# EAGLE design avr-node (EAGLE 7.2.0)
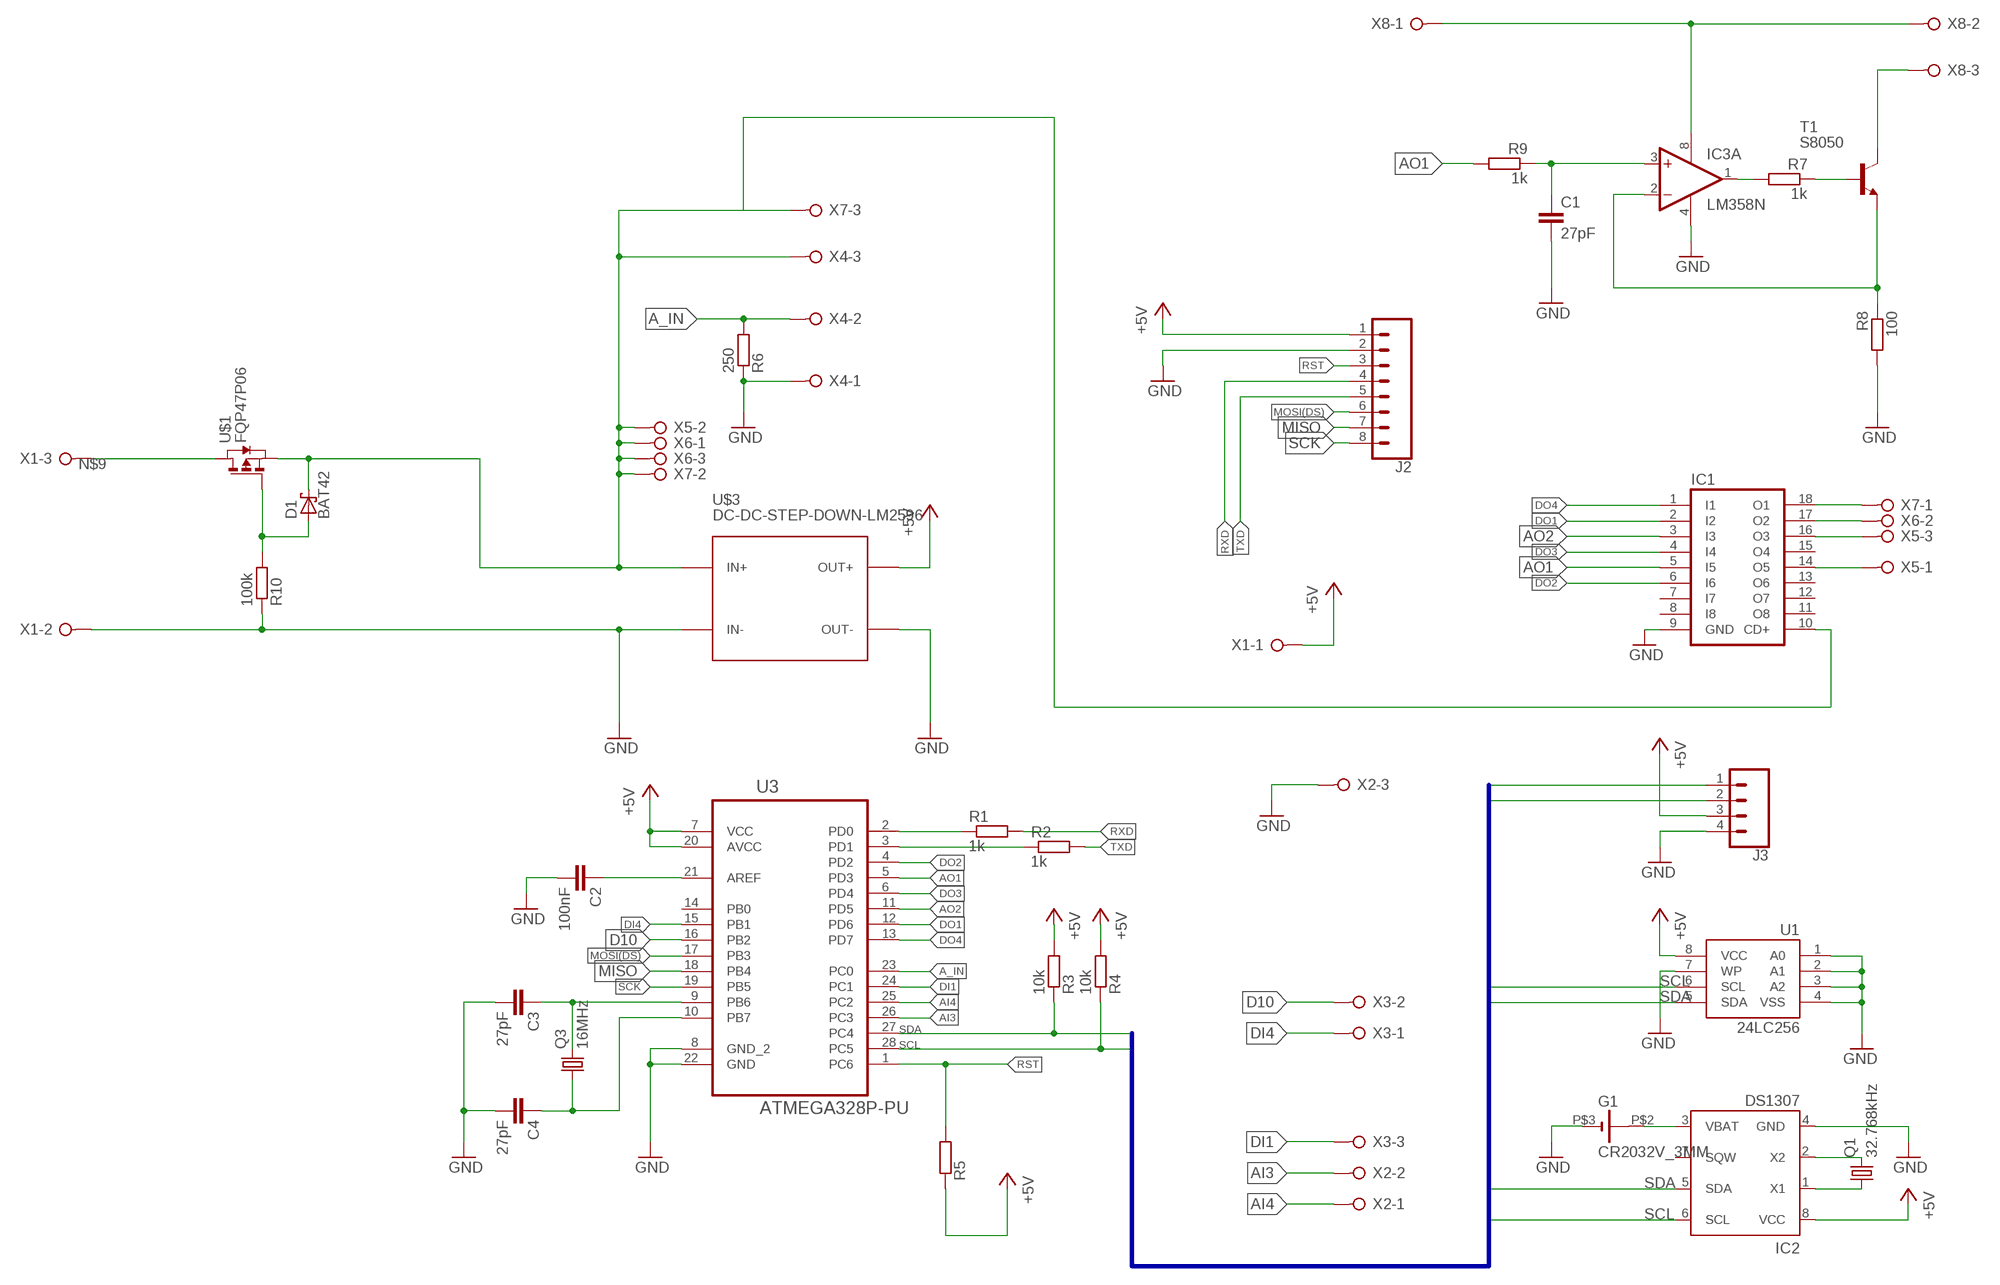
[diagram p0: schematic, sheet 1]

## Parts
C1  27pF  C-EU050-025X075  [C050-025X075]
C2  100nF  C-EU050-025X075  [C050-025X075]
C3  27pF  C-EU050-025X075  [C050-025X075]
C4  27pF  C-EU050-025X075  [C050-025X075]
D1  BAT42  [DO35-10]
G1  CR2032V_3MM  [CR2032V_3MM]
IC1  ULN2803A  [DIL18]
IC2  DS1307  [DIL08]
IC3  LM358N  [DIL08]
J2  CONN_08LONGPADS  [1X08_LONGPADS]
J3  CONN_04PTH  [1X04]
Q1  32.768kHz  CRYSTALTC26V  [TC26V]
Q3  16MHz  CRYSTALHC49U-V  [HC49U-V]
R1  1k  R-EU_0204/7  [0204/7]
R2  1k  R-EU_0204/7  [0204/7]
R3  10k  R-EU_0204/7  [0204/7]
R4  10k  R-EU_0204/7  [0204/7]
R5  R-EU_0204/7  [0204/7]
R6  250  R-EU_0204/7  [0204/7]
R7  1k  R-EU_0204/7  [0204/7]
R8  100  R-EU_0204/7  [0204/7]
R9  1k  R-EU_0204/7  [0204/7]
R10  100k  R-EU_0204/7  [0204/7]
T1  S8050  -NPN-TO92L  [TO92L]
U1  24LC256  EEPROM-I2CSMD  [SO08]
U3  ATMEGA328P-PU  [DIP254P762X457-28]
U$1  FQP47P06  [TO220]
U$3  DC-DC-STEP-DOWN-LM2596  [DC-DC-STEP-DOWN-LM2596]
X1  W237-3E  [W237-3E]
X2  W237-3E  [W237-3E]
X3  W237-3E  [W237-3E]
X4  W237-3E  [W237-3E]
X5  W237-3E  [W237-3E]
X6  W237-3E  [W237-3E]
X7  W237-3E  [W237-3E]
X8  W237-3E  [W237-3E]

## Nets
+5V: IC2.8(VCC) J2.1 J3.3 R3.2 R4.2 R5.1 U1.8(VCC) U3.7(VCC) U3.20(AVCC) U$3.OUT+ X1.1
A_IN: R6.2 U3.23(PC0) X4.2
AI3: U3.26(PC3) X2.2
AI4: U3.25(PC2) X2.1
AO1: IC1.5(I5) R9.2 U3.5(PD3)
AO2: IC1.3(I3) U3.11(PD5)
AO_SUP: IC3.8(P:V+) X8.1 X8.2
D10: U3.16(PB2) X3.2
DI1: U3.24(PC1) X3.3
DI4: U3.15(PB1) X3.1
DO1: IC1.2(I2) U3.12(PD6)
DO2: IC1.6(I6) U3.4(PD2)
DO3: IC1.4(I4) U3.6(PD4)
DO4: IC1.1(I1) U3.13(PD7)
GND: C1.2 C2.2 C3.2 C4.2 G1.P$3(-) IC1.9(GND) IC2.4(GND) IC3.4(P:V-) J2.2 J3.4 R6.1 R8.2 R10.1 U1.1(A0) U1.2(A1) U1.3(A2) U1.4(VSS) U1.7(WP) U3.8(GND_2) U3.22(GND) U$3.IN- U$3.OUT- X1.2 X2.3 X4.1
MISO: J2.7 U3.18(PB4)
MOSI(DS): J2.6 U3.17(PB3)
N$1: IC3.1(A:OUT) R7.2
N$2: R7.1 T1.2(B)
N$3: R1.1 U3.2(PD0)
N$4: R2.1 U3.3(PD1)
N$5: T1.3(C) X8.3
N$6: C2.1 U3.21(AREF)
N$7: C3.1 Q3.2 U3.9(PB6)
N$8: C4.1 Q3.1 U3.10(PB7)
N$9: U$1.2(D) X1.3
N$10: IC1.16(O3) X5.3
N$11: IC1.17(O2) X6.2
N$12: IC1.14(O5) X5.1
N$15: IC1.18(O1) X7.1
N$17: IC3.2(A:-IN) R8.1 T1.1(E)
N$18: D1.A R10.2 U$1.1(G)
N$20: C1.1 IC3.3(A:+IN) R9.1
N$22: IC2.2(X2) Q1.2
N$23: IC2.1(X1) Q1.1
N$28: G1.P$2(+) IC2.3(VBAT)
RST: J2.3 R5.2 U3.1(PC6)
RXD: J2.4 R1.2
SCK: J2.8 U3.19(PB5)
SCL: IC2.6(SCL) J3.1 R4.1 U1.6(SCL) U3.28(PC5)
SDA: IC2.5(SDA) J3.2 R3.1 U1.5(SDA) U3.27(PC4)
TXD: J2.5 R2.2
V_IN: D1.C IC1.10(CD+) U$1.3(S) U$3.IN+ X4.3 X5.2 X6.1 X6.3 X7.2 X7.3
Unconnected: G1.P$1(+) IC1.7(I7) IC1.8(I8) IC1.11(O8) IC1.12(O7) IC1.13(O6) IC1.15(O4) IC2.7(SQW) IC3.5(B:+IN) IC3.6(B:-IN) IC3.7(B:OUT) U3.14(PB0)

## Buses
I2C:SDA,SCL

## Library data of the parts
C1-C4 = resistor:C-EU: CAPACITOR, European symbol
D1 = diode:BAT42: DIODE barrier diode
G1 = battery:CR2032V_3MM
IC1 = uln-udn:ULN2803A: DRIVER ARRAY
IC2 = ds1307_pcf8583:DS1307: I2C-Bus CLOCK/CALENDAR
IC3 = linear:LM358: OP AMP also LM158; LM258; LM2904 Source: http://cache.national.com/ds/LM/LM158.pdf
J2 = SparkFun-Connectors:CONN_08: Multi connection point. Often used as Generic Header-pin footprint for 0.1 inch spaced/style header connections On any of the 0.1 inch spaced packages, you can populate with these: Break Away Headers - Straight <https://www.sparkfun.com/products/116> (PRT-00116) Break Away Male Headers - Right Angle <https://www.sparkfun.com/products/553> (PRT-00553) Female Headers <https://www.sparkfun.com/products/115> (PRT-00115) Break Away Headers - Machine Pin <https://www.sparkfun.com/products/117> (PRT-00117) Break Away Female Headers - Swiss Machine Pin <https://www.sparkfun.com/products/743> (PRT-00743) Arduino Stackable Header - 8 Pin <https://www.sparkfun.com/products/9279> (PRT-09279) For SCREWTERMINALS and SPRING TERMINALS visit here: Screw Terimnals on SparkFun.com <https://www.sparkfun.com/search/results?term=Screw+Terminals> (5mm/3.5mm/2.54mm spacing) This device is also useful as a general connection point to wire up your design to another part of your project. Our various solder wires solder well into these plated through hole pads. Hook-Up Wire - Assortment (Stranded, 22 AWG) <https://www.sparkfun.com/products/11375> (PRT-11375) Hook-Up Wire - Assortment (Solid Core, 22 AWG) <https://www.sparkfun.com/products/11367> (PRT-11367) View the entire wire category on our website here <https://www.sparkfun.com/categories/141> Special notes: Molex polarized connector foot print use with SKU : PRT-08231 with associated crimp pins and housings. 1MM SMD Version SKU: PRT-10208 NOTES ON THE VARIANTS LOCK and LOCK_LONGPADS... This footprint was designed to help hold the alignment of a through-hole component (i.e. 6-pin header) while soldering it into place. You may notice that each hole has been shifted either up or down by 0.005 of an inch from it's more standard position (which is a perfectly straight line). This slight alteration caused the pins (the squares in the middle) to touch the edges of the holes. Because they are alternating, it causes a "brace" to hold the component in place. 0.005 has proven to be the perfect amount of "off-center" position when using our standard breakaway headers. Although looks a little odd when you look at the bare footprint, once you have a header in there, the alteration is very hard to notice. Also,if you push a header all the way into place, it is covered up entirely on the bottom side.
J3 = SparkFun-Connectors:CONN_04: Multi connection point. Often used as Generic Header-pin footprint for 0.1 inch spaced/style header connections On any of the 0.1 inch spaced packages, you can populate with these: Break Away Headers - Straight <https://www.sparkfun.com/products/116> (PRT-00116) Break Away Male Headers - Right Angle <https://www.sparkfun.com/products/553> (PRT-00553) Female Headers <https://www.sparkfun.com/products/115> (PRT-00115) Break Away Headers - Machine Pin <https://www.sparkfun.com/products/117> (PRT-00117) Break Away Female Headers - Swiss Machine Pin <https://www.sparkfun.com/products/743> (PRT-00743) For SCREWTERMINALS and SPRING TERMINALS visit here: Screw Terimnals on SparkFun.com <https://www.sparkfun.com/search/results?term=Screw+Terminals> (5mm/3.5mm/2.54mm spacing) This device is also useful as a general connection point to wire up your design to another part of your project. Our various solder wires solder well into these plated through hole pads. Hook-Up Wire - Assortment (Stranded, 22 AWG) <https://www.sparkfun.com/products/11375> (PRT-11375) Hook-Up Wire - Assortment (Solid Core, 22 AWG) <https://www.sparkfun.com/products/11367> (PRT-11367) View the entire wire category on our website here <https://www.sparkfun.com/categories/141> Special notes: Molex polarized connector foot print use with SKU : PRT-08231 with associated crimp pins and housings. 1MM SMD Version SKU: PRT-10208; PROD_ID: CONN-09696
Q1 = adafruit:CRYSTAL: CRYSTAL; OC_FARNELL: unknown; OC_NEWARK: unknown
Q3 = crystal:CRYSTAL: CRYSTAL; OC_FARNELL: 1666969; OC_NEWARK: unknown
R1-R10 = resistor:R-EU_: RESISTOR, European symbol
T1 = transistor:*-NPN-: NPN Transistror BF959 corrected 2008.03.06
U1 = SparkFun-IC-Memory:EEPROM-I2C: I2C EEPROMs, 24LC256 and others 24LC256 Series 256 kb I2C 2 Wire (32 k x 8 Bit) 2.5 V Serial EEPROM SMD - SOIC-8 Datasheet SparkFun Products SparkFun UDB5 - PIC UAV Development Board <https://www.sparkfun.com/products/11703> (GPS-11703); PROD_ID: IC-09714
U3 = Atmel_By_element14_Batch_1-00:ATMEGA328P-PU: 8-bit Microcontroller with In-System Programmable Flash; MPN: ATMEGA328P-PU; OC_FARNELL: 1715487; OC_NEWARK: 15R0268; PACKAGE: PDIP-28; SUPPLIER: Atmel
U$1 = zetex:FQP47P06
U$3 = diy-modules:DC-DC-STEP-DOWN-LM2596: DC/DC Step-Down Regulator based on LM2596-ADJ chip LM2596 datasheet available here: http://www.ti.com/lit/ds/symlink/lm2596.pdf Click here to find device on ebay.com <http://www.ebay.com/sch/lm2596+power+regulator>
X1-X8 = con-wago-508:W237-3E: WAGO SREW CLAMP; OC_FARNELL: unknown; OC_NEWARK: unknown

## Board
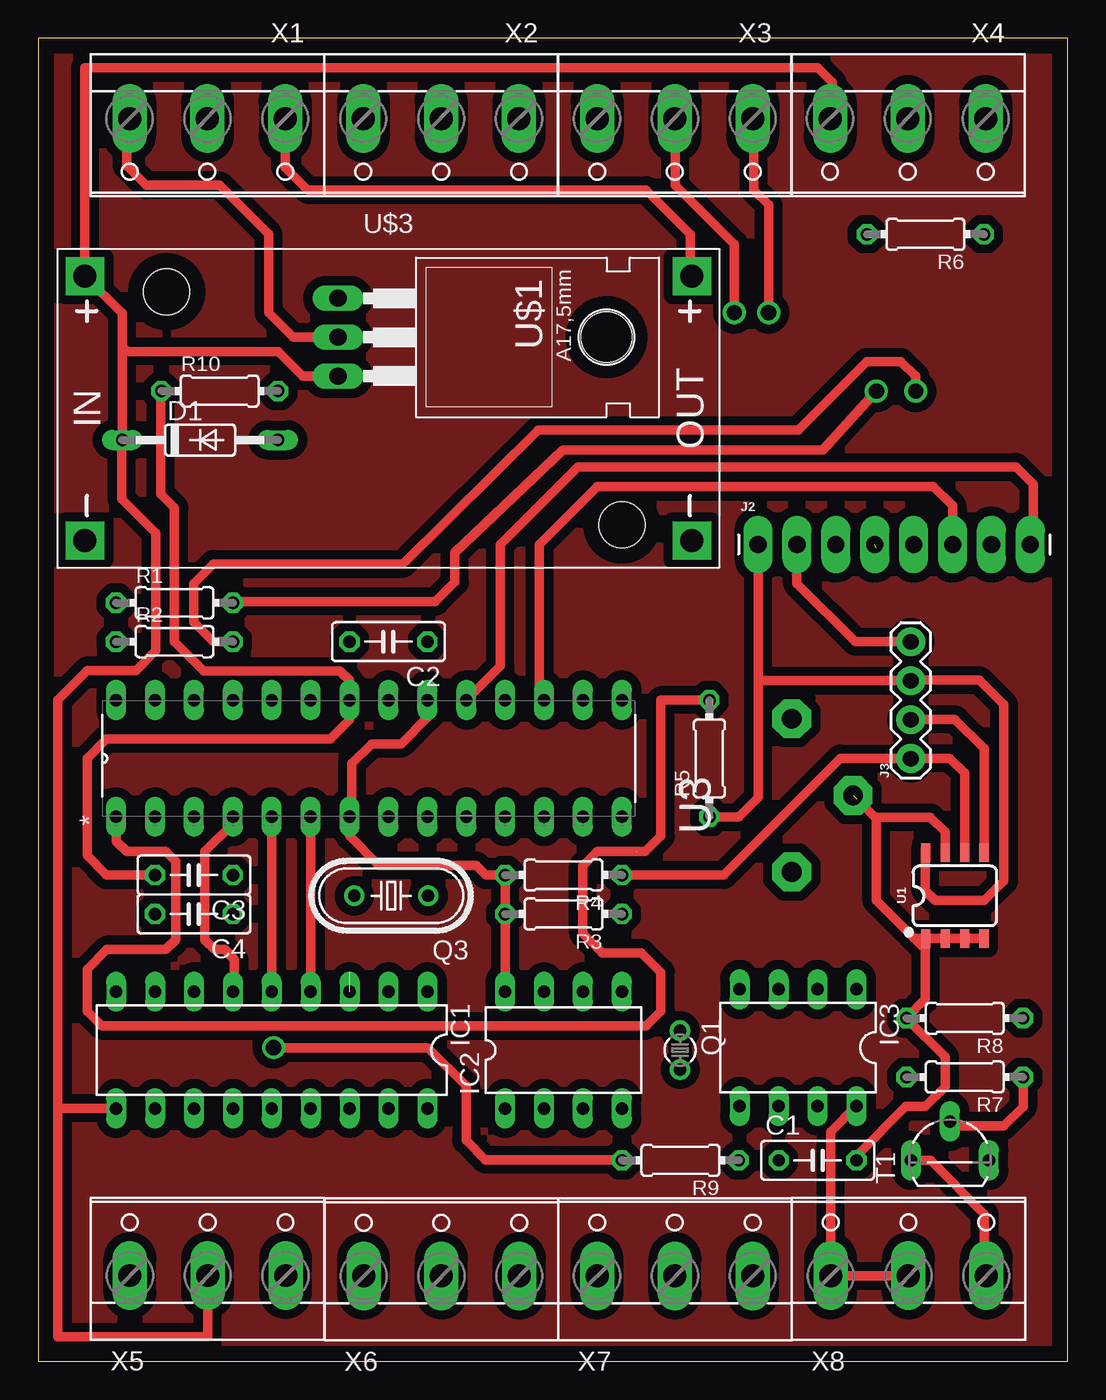
[diagram p1: board, top side]
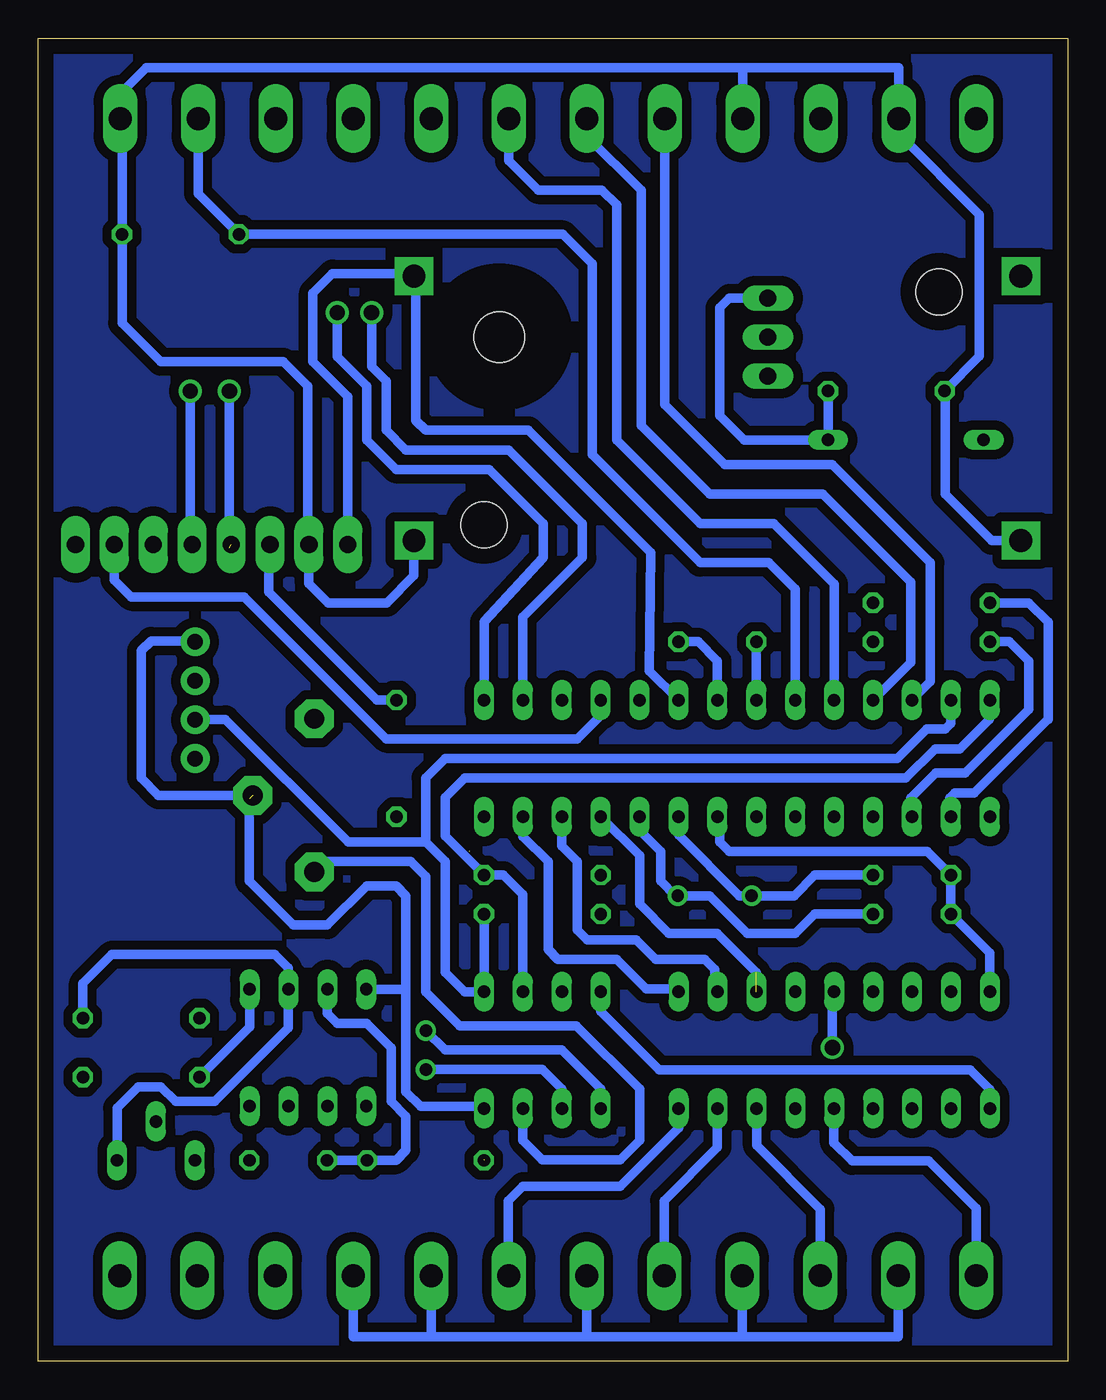
[diagram p2: board, bottom side, seen from below]

Size 67.2 x 86.4 mm. Coordinates in mm from the lower left corner, seen from the top.
Outline: 0,0 67.2,0 67.2,86.4 0,86.4 0,0
Copper layers (1*16): Top 0.035mm / dielectric 1.5mm / Bottom 0.035mm
Design rules "default": minimum track width 6mil, minimum drill 0.35mm, track to track 6mil, track to pad 6mil, pad to pad 6mil, via to via 6mil, smd to smd 6mil, copper to edge 40mil, drill to drill 6mil, minimum pad ring 10mil, minimum via ring 8mil, stop-mask expansion 4mil, vias tented up to drill 0mil, thermal gap 10mil

### Footprints (pad centres in the part's own frame; a part is rotated, then mirrored left to right if it is on the bottom)
C050-025X075 = drill 0.813 octagon: 1 -2.54,0; 2 2.54,0
DO35-10 = drill 0.813 long: A 5.08,0; C -5.08,0
CR2032V_3MM = drill 1.3 pad 2.54 octagon: P$1 0,0; P$2 0,-10; P$3 4,-5
DIL18 = drill 0.813 long: 1 -10.16,-3.81; 2 -7.62,-3.81; 3 -5.08,-3.81; 4 -2.54,-3.81; 5 0,-3.81; 6 2.54,-3.81; 7 5.08,-3.81; 8 7.62,-3.81; 9 10.16,-3.81; 10 10.16,3.81; 11 7.62,3.81; 12 5.08,3.81; 13 2.54,3.81; 14 0,3.81; 15 -2.54,3.81; 16 -5.08,3.81; 17 -7.62,3.81; 18 -10.16,3.81
DIL08 = drill 0.813 long: 1 -3.81,-3.81; 2 -1.27,-3.81; 3 1.27,-3.81; 4 3.81,-3.81; 5 3.81,3.81; 6 1.27,3.81; 7 -1.27,3.81; 8 -3.81,3.81
DIL08' = drill 0.813 pad 1.27 long: 1 -3.81,-3.81; 2 -1.27,-3.81; 3 1.27,-3.81; 4 3.81,-3.81; 5 3.81,3.81; 6 1.27,3.81; 7 -1.27,3.81; 8 -3.81,3.81
1X08_LONGPADS = drill 1.118 pad 1.88 long: 1 0,0; 2 2.54,0; 3 5.08,0; 4 7.62,0; 5 10.16,0; 6 12.7,0; 7 15.24,0; 8 17.78,0
1X04 = drill 1.016 pad 1.88: 1 0,0; 2 2.54,0; 3 5.08,0; 4 7.62,0
TC26V = drill 0.813: 1 -1.27,0; 2 1.27,0
HC49U-V = drill 0.813: 1 -2.413,0; 2 2.413,0
0204/7 = drill 0.813 octagon: 1 -3.81,0; 2 3.81,0
TO92L = drill 0.813 long: 1 0,-2.54; 2 2.54,0; 3 0,2.54
SO08 = smd 0.6 x 1.2: 1 -1.905,-2.8; 2 -0.635,-2.8; 3 0.635,-2.8; 4 1.905,-2.8; 5 1.905,2.8; 6 0.635,2.8; 7 -0.635,2.8; 8 -1.905,2.8
DIP254P762X457-28 = drill 0.813 long: 1 -7.62,33.02; 2 -7.62,30.48; 3 -7.62,27.94; 4 -7.62,25.4; 5 -7.62,22.86; 6 -7.62,20.32; 7 -7.62,17.78; 8 -7.62,15.24; 9 -7.62,12.7; 10 -7.62,10.16; 11 -7.62,7.62; 12 -7.62,5.08; 13 -7.62,2.54; 14 -7.62,0; 15 0,0; 16 0,2.54; 17 0,5.08; 18 0,7.62; 19 0,10.16; 20 0,12.7; 21 0,15.24; 22 0,17.78; 23 0,20.32; 24 0,22.86; 25 0,25.4; 26 0,27.94; 27 0,30.48; 28 0,33.02
TO220 = drill 1.118 long: 1 -2.54,-6.35; 2 0,-6.35; 3 2.54,-6.35 | hole 3.302: 0,11.176
DC-DC-STEP-DOWN-LM2596 = drill 1.5 pad 2.5 square: IN+ -19.812,8.636; IN- -19.812,-8.636; OUT+ 19.812,8.636; OUT- 19.812,-8.636 | hole 3: -14.478,7.62; 15.24,-7.62
W237-3E = drill 1.5 pad 2.184 long: 1 -5.08,-0.635; 2 0,-0.635; 3 5.08,-0.635

### Placement (x,y rotation side)
C1  50.88,13.12 0 top
C2  22.86,46.99 180 top
C3  10.16,31.75 180 top
C4  10.16,29.21 180 top
D1  10.56,60.16 0 top
G1  49.19,41.96 0 top
IC1  15.24,20.32 180 top
IC2  34.29,20.32 0 top
IC3  LM358N  [DIL08']  49.6,20.48 180 top
J2  46.99,53.34 0 top
J3  56.96,39.36 90 top
Q1  41.9,20.32 270 top
Q3  23.04,30.4 180 top
R1  8.89,49.53 0 top
R2  8.89,46.99 0 top
R3  34.29,29.21 180 top
R4  34.29,31.75 180 top
R5  43.81,39.37 90 top
R6  57.92,73.6 180 top
R7  60.48,18.56 180 top
R8  60.48,22.4 180 top
R9  41.92,13.12 180 top
R10  11.84,63.36 0 top
T1  59.52,13.12 90 top
U1  59.84,30.4 0 top
U3  38.1,43.18 90 top
U$1  25.92,66.88 270 top
U$3  22.86,62.23 0 top
X1  11.04,80.52 180 top
X2  26.3,80.52 180 top
X3  41.56,80.52 180 top
X4  56.77,80.52 180 top
X5  11.06,6.23 0 top
X6  26.32,6.2 0 top
X7  41.56,6.21 0 top
X8  56.81,6.22 0 top

### Tracks (layer width: path | path; a pad name or v marks a point on that pad's centre or on a via)
+5V
  Top 0.61: IC2.8 R3.2 R4.2 29.21,31.75 28.58,32.38 22.23,32.38 20.32,34.29 U3.7 20.48,35.72 20.48,39.04 21.76,40.32 23.68,40.32 25.4,42.04 U3.20 | R5.1 45.72,35.56 46.99,36.83 46.99,44.48 | 46.99,44.48 47.02,44.45 57.59,44.45 J3.3 57.64,44.48 61.44,44.48 63.04,42.88 63.04,31.36 61.76,30.08 58.56,30.08 57.92,30.72 57.92,33.51 U1.8 | 46.99,44.48 J2.1 | X1.1 16.12,77.96 17.6,76.48 39.68,76.48 42.56,73.6 42.56,70.98 U$3.OUT+
  Bottom 0.61: 5.08,17.77 6.35,19.04 26.66,19.04 30.48,22.86 IC2.8 | U3.20 27.3,45.08 27.2,52.8 35.2,60.8 41.92,60.8 42.56,61.44 42.56,70.75 U$3.OUT+ 42.85,71.04 48,71.04 49.28,69.76 49.28,65.28 46.99,62.99 J2.1 | 57.61,44.45 J3.3
A_IN
  Bottom 0.61: U3.23 17.78,50.42 19.52,52.16 24,52.16 31.04,59.2 31.04,71.68 32.96,73.6 R6.2 56.77,76.26 X4.2
AI3
  Bottom 0.61: U3.26 8.96,44.38 8.96,52.16 15.36,58.56 22.4,58.56 26.3,62.46 X2.2
AI4
  Bottom 0.61: U3.25 10.24,45.64 10.24,50.88 16,56.64 23.36,56.64 27.84,61.12 27.84,76.48 31.38,80.02 X2.1
AO1  (via drill 1)  (1 unrouted)
  Top 0.61: U3.5 IC1.5 | v15.36,20.48 25.44,20.48 27.92,18 27.92,14.41 29.18,13.16 38.07,13.16
  Bottom 0.61: v15.36,20.48 15.36,23.93 IC1.5
AO2  (1 unrouted)
  Bottom 0.61: 20.32,25.4 22.86,27.94 26.03,27.94 27.94,29.85 27.94,33.02 U3.11
AO_SUP
  Top 0.61: IC3.8 51.73,14.99 X8.1 X8.2
D10  (via drill 1)
  Top 0.61: v45.44,68.48 45.44,72.96 41.6,76.8 41.6,81.11 X3.2
  Bottom 0.61: U3.16 35.56,48.6 31.68,52.48 31.68,54.72 36.48,59.52 43.2,59.52 44.48,60.8 44.48,64 45.44,64.96 v45.44,68.48
DI1
  Bottom 0.61: U3.24 15.24,50.76 19.2,54.72 24,54.72 29.44,60.16 29.44,75.52 30.4,76.48 34.56,76.48 36.48,78.4 X3.3
DI4  (via drill 1)
  Top 0.61: v47.68,68.48 47.68,75.52 46.72,76.48 46.72,81.08 X3.1
  Bottom 0.61: U3.15 38.1,48.3 34.24,52.48 34.24,54.72 37.76,58.24 43.84,58.24 45.76,60.16 45.76,63.68 47.68,65.6 v47.68,68.48
DO1
  Bottom 0.61: U3.12 33.02,33.66 32,32.64 32,28.16 31.36,27.52 28.16,27.52 26.88,26.24 23.68,26.24 23.04,25.6 23.04,24.31 IC1.2
DO2
  Top 0.61: U3.4 12.7,35.1 10.88,33.28 10.88,27.52 11.52,26.88 12.16,26.88 12.8,26.24 12.8,24.23 IC1.6
DO3
  Top 0.61: U3.6 IC1.4
DO4
  Bottom 0.61: U3.13 35.56,34.28 33.92,32.64 33.92,26.88 33.28,26.24 29.44,26.24 27.52,24.32 25.59,24.32 IC1.1
GND  (1 unrouted)
  Top 0.61: C3.2 4.45,31.75 3.18,33.02 3.18,39.37 4.45,40.64 19.05,40.64 20.32,41.91 U3.22 20.32,44.45 19.69,45.08 10.8,45.08 8.89,46.99 8.89,55.75 8,56.64 8,63.33 R10.1 | J2.2 49.53,50.8 53.34,46.99 57.59,46.99 J3.4 | 57.2,27.6 U1.1 U1.2 U1.3 U1.4 | 57.2,27.6 57.92,26.88 57.92,23.65 R8.2 59.2,19.87 59.2,17.92 57.92,16.64 56.64,16.64 53.42,13.42 C1.2 | U1.7 59.2,34.55 58.24,35.52 54.72,35.52 | 54.72,35.52 54.63,35.52 G1.P$3 | 57.2,27.6 54.72,30.08 54.72,35.52
  Bottom 0.61: IC1.9 5.08,26.67 C4.2 C3.2 9.15,33.28 22.08,33.28 22.72,33.92 22.72,35.42 U3.8 | U$3.OUT- 42.67,51.31 44.45,49.53 48.26,49.53 49.53,50.8 J2.2 49.6,53.41 49.6,63.68 51.2,65.28 59.2,65.28 61.73,67.81 R6.1 61.73,81.03 X4.1 61.85,82.79 60.16,84.48 21.22,84.48 | C2.2 U3.22 | 21.22,84.48 X2.3 | 21.22,84.48 11.04,84.48 X1.2 11.04,80.16 5.76,74.88 5.76,65.63 R10.1 8,63.33 8,56.64 4.95,53.59 U$3.IN- | 43.2,24.29 43.2,30.4 43.84,31.04 45.76,31.04 48.32,28.48 50.56,28.48 53.44,31.36 53.44,36.71 | 43.2,24.29 43.2,17.6 42.24,16.64 38.23,16.64 IC2.4 | IC3.4 43.2,24.29 | G1.P$3 59.36,36.96 60.48,38.08 60.48,46.4 59.84,47.04 57.02,47.04 J3.4
MISO
  Bottom 0.61: J2.7 62.23,51.03 61.12,49.92 53.76,49.92 44.48,40.64 32,40.64 30.4,42.24 30.4,43.1 U3.18
MOSI(DS)
  Top 0.61: J2.6 59.69,55.87 58.43,57.13 36.49,57.13 32.7,53.34 32.7,43.5 U3.17
N$1
  Bottom 0.61: IC3.1 53.41,21.82 R7.2
N$2
  Top 0.61: R7.1 64.29,16.61 63.04,15.36 59.85,15.36 T1.2
N$3
  Bottom 0.61: R1.1 2.54,49.53 1.27,48.26 1.27,41.91 1.29,41.91 6.08,37.12 7.36,37.12 7.68,36.8 7.68,35.62 U3.2
N$4
  Bottom 0.61: R2.1 3.81,46.99 2.54,45.72 2.54,42.55 6.67,38.42 8.62,38.42 10.24,36.8 10.24,35.64 U3.3
N$5
  Top 0.61: T1.3 58.25,13.11 61.76,9.6 61.76,5.71 X8.3
N$6
  Bottom 0.61: C2.1 24.13,46.99 22.86,45.72 U3.21
N$7
  Bottom 0.61: C3.1 16.51,31.75 17.86,30.4 Q3.2 21.44,30.4 25.4,34.36 U3.9
N$8
  Bottom 0.61: C4.1 16.51,29.21 17.78,27.94 20.9,27.94 23.36,30.4 Q3.1 25.6,30.4 26.56,31.36 26.56,33.28 27.84,34.56 27.84,35.46 U3.10
N$9
  Top 0.61: U$1.2 16.64,66.88 15.04,68.48 15.04,73.6 11.84,76.8 7.04,76.8 5.76,78.08 5.76,80.95 X1.3
N$10
  Bottom 0.61: X5.3 16.14,9.94 20.29,14.08 20.29,16.48 IC1.16
N$11
  Bottom 0.61: IC1.17 22.86,13.97 26.35,10.48 26.35,6.55 X6.2
N$12
  Bottom 0.61: X5.1 5.98,10 9.06,13.08 14.06,13.08 15.25,14.27 15.25,16.5 IC1.14
N$14
  pour Bottom (isolate 0.61): 0,86.4 67.2,86.4 67.2,0 0,0
N$15
  Bottom 0.61: IC1.18 25.4,15.24 29.21,11.43 35.56,11.43 36.51,10.48 36.51,6.25 X7.1
N$16
  pour Top (isolate 0.61): 0,86.4 67.2,86.4 67.2,0 0,0
N$17
  Bottom 0.61: R8.1 64.29,24.67 62.4,26.56 51.78,26.56 50.9,25.68 50.9,24.32 IC3.2 50.87,21.77 55.68,16.96 58.24,16.96 59.2,17.92 60.67,17.92 62.05,16.55 62.05,13.13 T1.1
N$18
  Bottom 0.61: U$1.1 19.59,69.44 22.08,69.44 22.72,68.8 22.72,61.76 21.12,60.16 D1.A R10.2
N$20
  Bottom 0.61: IC3.3 48.32,22.72 47.68,22.08 45.76,22.08 44.16,20.48 44.16,16.96 43.2,16 43.2,13.76 43.84,13.12 R9.1 C1.1
N$22
  Bottom 0.61: IC2.2 33.02,17.78 34.29,19.05 Q1.2
N$23
  Bottom 0.61: IC2.1 30.48,17.78 33.02,20.32 40.63,20.32 Q1.1
N$28
  Bottom 0.61: IC2.3 35.56,14.43 34.29,13.16 29.21,13.16 27.94,14.43 27.94,17.78 32.07,21.91 39.69,21.91 41.91,24.13 41.91,31.67 42.88,32.64 48.51,32.64 G1.P$2
RST  (1 unrouted)
  Top 0.61: U3.1 5.08,33.96 5.76,33.28 8.32,33.28 8.96,32.64 8.96,27.52 8.32,26.88 4.48,26.88 3.2,25.6 3.2,22.84 4.13,21.91 39.69,21.91 40.64,22.86 40.64,25.4 39.37,26.67 36.83,26.67 35.56,27.94 35.56,32.36 36.48,33.28 39.04,33.28 | 39.06,33.28 39.63,33.28 40.64,34.29 40.64,43.18 R5.2
  Bottom 0.61: R5.2 45.1,43.18 52.16,50.24 52.16,53.25 J2.3
RXD  (via drill 1)  (1 unrouted)
  Top 0.61: R1.2 12.77,49.6 25.92,49.6 27.2,50.88 27.2,52.8 34.24,59.52 51.2,59.52 v54.72,63.36
  Bottom 0.61: v54.72,63.36 54.72,53.12 55.04,52.8
SCK
  Top 0.61: U3.19 30.16,45.4 30.16,53.34 35.22,58.4 63.84,58.4 64.96,57.28 64.96,53.53 J2.8
SCL
  Top 0.61: R4.1 44.75,31.75 52.37,39.37 57.59,39.37 J3.1 59.52,39.36 60.48,38.41 U1.6
  Bottom 0.61: IC2.6 35.56,30.48 36.83,31.75 R4.1 40.64,34.29 40.64,36.83 39.37,38.1 10.56,38.08 8.64,40 7.04,40 5.12,41.92 U3.28
SDA
  Top 0.61: U1.5 61.74,40.02 59.84,41.92 57.62,41.92 J3.2
  Bottom 0.61: R3.1 IC2.5 39.37,24.13 40.64,25.4 40.64,32.64 41.92,33.92 | U3.27 7.62,41.66 8,41.28 9.21,41.28 11.12,39.37 40.64,39.37 41.91,38.1 41.92,38.1 41.92,33.92 | J3.2 57.58,41.92 54.98,41.92 46.98,33.92 41.92,33.92
TXD  (via drill 1)
  Top 0.61: R2.2 11.43,46.99 10.16,48.26 10.16,50.8 11.43,52.07 23.81,52.07 32.64,60.8 49.6,60.8 54.08,65.28 56.32,65.28 57.28,64.32 v57.28,63.36
  Bottom 0.61: v57.28,63.36 57.28,53.47 J2.5
V_IN
  Top 0.61: X4.3 51.84,81.31 51.84,83.52 50.88,84.48 3.05,84.48 U$3.IN+ | U$3.IN+ 3.37,70.87 | 1.28,16.3 1.28,43.2 3.2,45.12 6.4,45.12 7.68,46.4 7.68,54.08 5.44,56.32 5.44,60.12 D1.C 5.48,66.24 | 1.28,16.3 1.28,1.6 11.06,1.6 X5.2 | 5.48,66.24 5.48,68.43 U$3.IN+ | U$1.3 17.26,64.34 15.68,65.92 5.8,65.92 5.48,66.24 | IC1.10 1.49,16.51 1.28,16.3
  Bottom 0.61: X5.2 11.06,1.6 21.24,1.6 | 21.24,1.6 31.4,1.6 | 31.4,1.6 41.56,1.6 | X6.1 21.24,1.6 | X6.3 31.4,1.6 | X7.2 41.56,1.6 | 41.56,1.6 46.64,1.6 X7.3